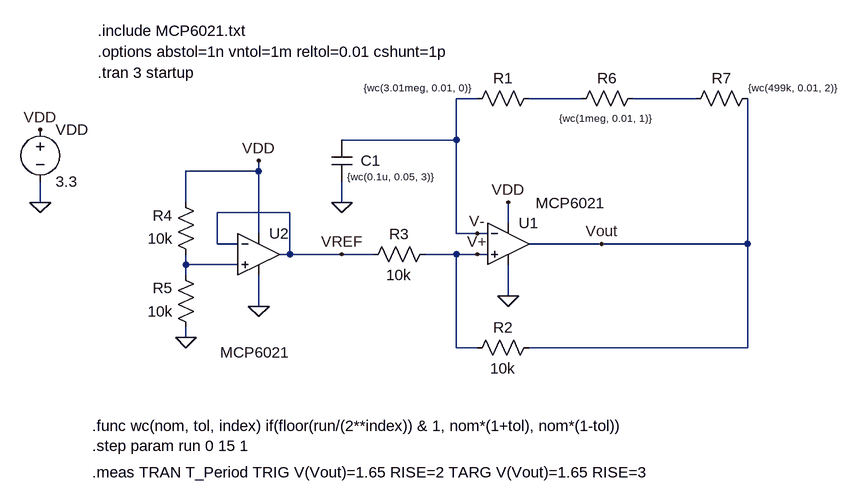
[diagram p0: schematic wc_MP1.asc]
wc_MP1.asc, the LTspice schematic file:
Version 4
SHEET 1 928 680
WIRE 32 -128 0 -128
WIRE 192 -128 112 -128
WIRE 368 -128 272 -128
WIRE 0 -64 0 -128
WIRE 0 -64 -176 -64
WIRE -304 -16 -304 -32
WIRE -304 -16 -416 -16
WIRE -640 32 -640 0
WIRE -416 32 -416 -16
WIRE -176 32 -176 0
WIRE -256 48 -368 48
WIRE 80 64 80 32
WIRE -304 80 -304 -16
WIRE 0 80 0 -64
WIRE 32 80 0 80
WIRE 48 80 32 80
WIRE -368 96 -368 48
WIRE -336 96 -368 96
WIRE 224 96 112 96
WIRE 448 96 448 -128
WIRE 448 96 224 96
WIRE -256 112 -256 48
WIRE -256 112 -272 112
WIRE -176 112 -256 112
WIRE -128 112 -176 112
WIRE 0 112 -48 112
WIRE 32 112 0 112
WIRE 48 112 32 112
WIRE -416 128 -416 112
WIRE -336 128 -416 128
WIRE -416 144 -416 128
WIRE 80 176 80 128
WIRE -304 192 -304 144
WIRE -416 240 -416 224
WIRE 0 256 0 112
WIRE 32 256 0 256
WIRE 448 256 448 96
WIRE 448 256 112 256
FLAG 224 96 Vout
FLAG 80 176 0
FLAG -176 32 0
FLAG -640 32 0
FLAG -640 -80 VDD
FLAG 80 32 VDD
FLAG -304 -32 VDD
FLAG -416 240 0
FLAG -304 192 0
FLAG -176 112 VREF
FLAG 32 112 V+
FLAG 32 80 V-
SYMBOL OpAmps/opamp2 80 32 R0
WINDOW 3 42 1 Left 2
SYMATTR Value MCP6021
SYMATTR InstName U1
SYMBOL Voltage -640 -96 R0
SYMATTR InstName VDD
SYMATTR Value 3.3
SYMBOL res 128 -144 R90
WINDOW 0 0 56 VBottom 2
WINDOW 3 -11 189 VTop 1
SYMATTR InstName R1
SYMATTR Value {wc(3.01meg, 0.01, 0)}
SYMATTR SpiceLine tol=1
SYMBOL cap -192 -64 R0
WINDOW 0 45 32 Left 2
WINDOW 3 24 56 Left 1
SYMATTR InstName C1
SYMATTR Value {wc(0.1u, 0.05, 3)}
SYMBOL res 128 240 R90
WINDOW 0 0 56 VBottom 2
WINDOW 3 32 56 VTop 2
SYMATTR InstName R2
SYMATTR Value 10k
SYMATTR SpiceLine tol=1
SYMBOL res -32 96 R90
WINDOW 0 0 56 VBottom 2
WINDOW 3 32 56 VTop 2
SYMATTR InstName R3
SYMATTR Value 10k
SYMATTR SpiceLine tol=1
SYMBOL res -400 128 R180
WINDOW 0 36 76 Left 2
WINDOW 3 36 40 Left 2
SYMATTR InstName R4
SYMATTR Value 10k
SYMATTR SpiceLine tol=1
SYMBOL res -400 240 R180
WINDOW 0 36 76 Left 2
WINDOW 3 36 40 Left 2
SYMATTR InstName R5
SYMATTR Value 10k
SYMATTR SpiceLine tol=1
SYMBOL OpAmps/opamp2 -304 48 R0
WINDOW 3 -59 215 Left 2
SYMATTR Value MCP6021
SYMATTR InstName U2
SYMBOL res 288 -144 R90
WINDOW 0 0 56 VBottom 2
WINDOW 3 57 59 VBottom 1
SYMATTR InstName R6
SYMATTR Value {wc(1meg, 0.01, 1)}
SYMATTR SpiceLine tol=1
SYMBOL res 464 -144 R90
WINDOW 0 0 56 VBottom 2
WINDOW 3 -11 -53 VTop 1
SYMATTR InstName R7
SYMATTR Value {wc(499k, 0.01, 2)}
SYMATTR SpiceLine tol=1
TEXT -552 -232 Left 2 !.include MCP6021.txt
TEXT -552 -168 Left 2 !.tran 3 startup
TEXT -552 -200 Left 2 !.options abstol=1n vntol=1m reltol=0.01 cshunt=1p
TEXT -560 376 Left 2 !.func wc(nom, tol, index) if(floor(run/(2**index)) & 1, nom*(1+tol), nom*(1-tol))\n.step param run 0 15 1
TEXT -560 448 Left 2 !.meas TRAN T_Period TRIG V(Vout)=1.65 RISE=2 TARG V(Vout)=1.65 RISE=3

The netlist it stands for:
* wc_MP1.asc
XU1 V+ V- VDD 0 Vout MCP6021  ; pins In+ In- V+ V- OUT
VDD VDD 0 3.3
R1 N001 V- {wc(3.01meg, 0.01, 0)} tol=1
C1 V- 0 {wc(0.1u, 0.05, 3)}
R2 Vout V+ 10k tol=1
R3 V+ VREF 10k tol=1
R4 N003 VDD 10k tol=1
R5 0 N003 10k tol=1
XU2 N003 VREF VDD 0 VREF MCP6021  ; pins In+ In- V+ V- OUT
R6 N002 N001 {wc(1meg, 0.01, 1)} tol=1
R7 Vout N002 {wc(499k, 0.01, 2)} tol=1
.include MCP6021.txt
.tran 3 startup
.options abstol=1n vntol=1m reltol=0.01 cshunt=1p
.func wc(nom, tol, index) if(floor(run/(2**index)) & 1, nom*(1+tol), nom*(1-tol))
.step param run 0 15 1
.meas TRAN T_Period TRIG V(Vout)=1.65 RISE=2 TARG V(Vout)=1.65 RISE=3
.backanno
.end